# Altium schematic sheet MCU And Peripherals.SchDoc
size A4; SheetNumber: 2; SheetTotal: 4
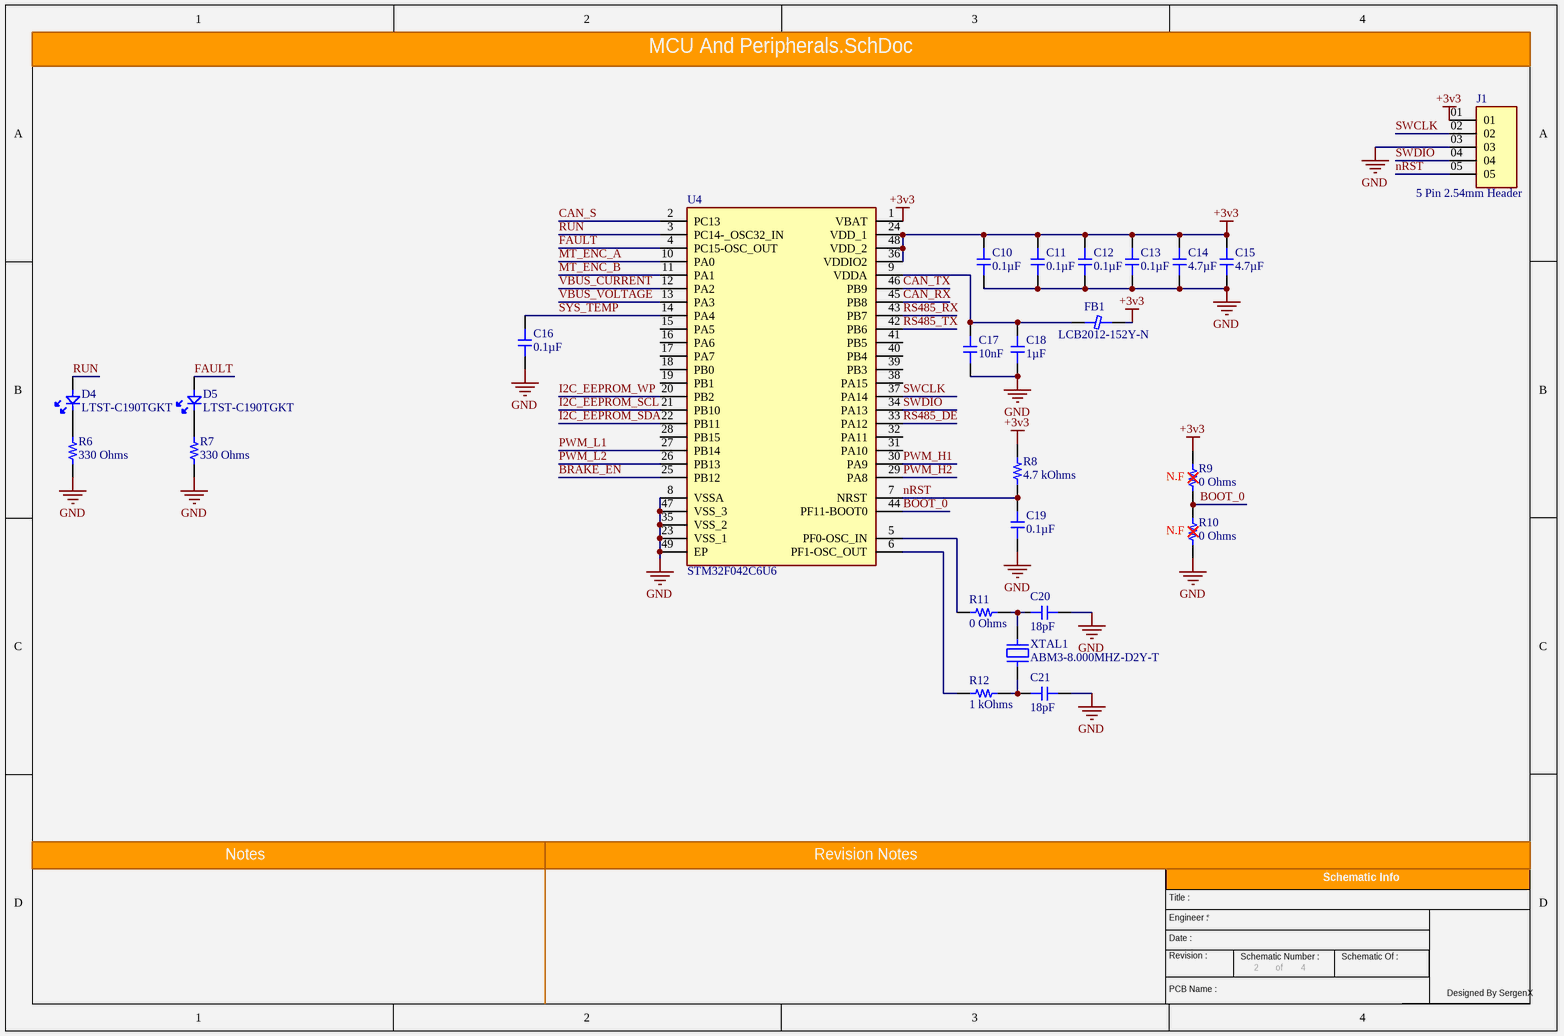
[diagram p0: MCU And Peripherals.SchDoc]

## Parts
C10  0.1µF  [0603_Footprint]
C11  0.1µF  [0603_Footprint]
C12  0.1µF  [0603_Footprint]
C13  0.1µF  [0603_Footprint]
C14  4.7µF  [0603_Footprint]
C15  4.7µF  [0603_Footprint]
C16  0.1µF  [0603_Footprint]
C17  10nF  [0603_Footprint]
C18  1µF  [0603_Footprint]
C19  0.1µF  [0603_Footprint]
C20  18pF  [0603_Footprint]
C21  18pF  [0603_Footprint]
D4  LTST-C190TGKT  [LEDC1608X80N]
D5  LTST-C190TGKT  [LEDC1608X80N]
FB1  LCB2012-152Y-N  [Inductor-0805]
J1  5 Pin 2.54mm Header  [5PIN_254MM]
R6  330 Ohms  [0603_RES]
R7  330 Ohms  [0603_RES]
R8  4.7 kOhms  [0603_RES]
R9  0 Ohms  [0603_RES]
R10  0 Ohms  [0603_RES]
R11  0 Ohms  [0603_RES]
R12  1 kOhms  [0603_RES]
U4  STM32F042C6U6  [QFN50P700X700X60-49N]
XTAL1  ABM3-8.000MHZ-D2Y-T  [ABM3]

## Nets
+3v3: C10.1 C11.1 C12.1 C13.1 C14.1 C15.1 FB1.2 J1.01 R8.2 R9.2 U4.1(VBAT) U4.24(VDD_1) U4.36(VDDIO2) U4.48(VDD_2)
GND: C10.2 C11.2 C12.2 C13.2 C14.2 C15.2 C16.2 C17.2 C18.2 C19.1 C20.2 C21.2 J1.03 R6.1 R7.1 R10.1 U4.8(VSSA) U4.23(VSS_1) U4.35(VSS_2) U4.47(VSS_3) U4.49(EP)
BOOT_0: R9.1 R10.2 U4.44(PF11-BOOT0)
BRAKE_EN: U4.25(PB12)
CAN_RX: U4.45(PB8)
CAN_S: U4.2(PC13)
CAN_TX: U4.46(PB9)
FAULT: D5.2(A) U4.4(PC15-OSC_OUT)
I2C_EEPROM_SCL: U4.21(PB10)
I2C_EEPROM_SDA: U4.22(PB11)
I2C_EEPROM_WP: U4.20(PB2)
MT_ENC_A: U4.10(PA0)
MT_ENC_B: U4.11(PA1)
nRST: C19.2 J1.05 R8.1 U4.7(NRST)
PWM_H1: U4.30(PA9)
PWM_H2: U4.29(PA8)
PWM_L1: U4.27(PB14)
PWM_L2: U4.26(PB13)
RS485_DE: U4.33(PA12)
RS485_RX: U4.43(PB7)
RS485_TX: U4.42(PB6)
RUN: D4.2(A) U4.3(PC14-_OSC32_IN)
SWCLK: J1.02 U4.37(PA14)
SWDIO: J1.04 U4.34(PA13)
SYS_TEMP: C16.1 U4.14(PA4)
VBUS_CURRENT: U4.12(PA2)
VBUS_VOLTAGE: U4.13(PA3)
NetC17_1: C17.1 C18.1 FB1.1 U4.9(VDDA)
NetC20_1: C20.1 R11.2 XTAL1.2
NetC21_1: C21.1 R12.2 XTAL1.1
NetD4_1: D4.1(K) R6.2
NetD5_1: D5.1(K) R7.2
NetR11_1: R11.1 U4.5(PF0-OSC_IN)
NetR12_1: R12.1 U4.6(PF1-OSC_OUT)

Not connected (* = marked no-connect by the designer): U4 15(PA5) 16(PA6) 17(PA7) 18(PB0) 19(PB1) 28(PB15) 31(PA10) 32(PA11) 38(PA15) 39(PB3) 40(PB4) 41(PB5)

## Notes on the sheet
- (near R9) N.F
- (near R10) N.F
- Notes
- Revision Notes
- Title :
- Engineer :
- Schematic Info
- Date :
- Revision :
- PCB Name :
- Schematic Number :
- of
- Schematic Of :
- Designed By SergenX

## Library data of the parts
C10-C13 C16 C19 = 0.1uF 0603 Surface Capacitor
C14 C15 = 4.7uF 0603 Surface Capacitor
C17 = 10nF 0603 Surface Capacitor
C18 = 1uF 0603 Surface Capacitor
C20 C21 = 18pF 0603 Surface Capacitor
D4 D5 = LTST-C190TGKT: 20mA Generic 0603 Led SMD; Manufacturer_Name: Lite-On; Manufacturer_Part_Number: LTST-C190KRKT; Datasheet Link: https://componentsearchengine.com/Datasheets/1/LTST-C190KRKT.pdf; Height: 0.8mm; Mouser Part Number: 859-LTST-C190KRKT; Mouser Price/Stock: https://www.mouser.co.uk/ProductDetail/Lite-On/LTST-C190KRKT?qs=kAD5fFa1n5VY3YYNWPC1Fg%3D%3D; Arrow Part Number: LTST-C190KRKT; Arrow Price/Stock: https://www.arrow.com/en/products/ltst-c190krkt/lite-on-technology?region=europe
FB1 = LCB2012-152Y-N: Ferrite Bead 1A 0805 SMD
J1 = 5 Pin 2.54mm Header: Generic 2.54MM 5 Pin Header; MP: MTSW-105-09-G-S-480; Availability: Unavailable; Package: None; Value: *; Price: None
R6 R7 = 330 Ohm 0603
R8 = 4.7 kOhms 0603
R9-R11 = 0 Ohm 0603
R12 = 1 kOhms 0603
U4 = STM32F042C6U6: STMICROELECTRONICS - STM32F042C6U6 - MCU, ARM CORTEX-M0, 48MHZ, UFQFPN-48; Geometry.Height: 0.65mm; Manufacturer_Name: STMicroelectronics; Manufacturer_Part_Number: STM32F042C6U6; Mouser Part Number: 511-STM32F042C6U6; Mouser Price/Stock: https://www.mouser.co.uk/ProductDetail/STMicroelectronics/STM32F042C6U6?qs=4l9S5vBWkUI%2FX%2FLe94sSqA%3D%3D; Arrow Part Number: STM32F042C6U6; Arrow Price/Stock: https://www.arrow.com/en/products/stm32f042c6u6/stmicroelectronics; Datasheet Link: https://www.st.com/resource/en/datasheet/stm32f042c6.pdf
XTAL1 = ABM3-8.000MHZ-D2Y-T: 8MHz 2 Pin SMD Crystal; Manufacturer_Name: ABRACON; Datasheet Link: https://abracon.com/Resonators/abm3.pdf; Height: 1.3mm; Manufacturer_Part_Number: ABM3-8.000MHZ-D2Y-T; Mouser Part Number: 815-ABM3-8-D2Y-T; Mouser Price/Stock: https://www.mouser.co.uk/ProductDetail/ABRACON/ABM3-8.000MHZ-D2Y-T?qs=ihRgKfnEsN4giUXjc3yS1g%3D%3D; Arrow Part Number: ABM3-8.000MHZ-D2Y-T; Arrow Price/Stock: https://www.arrow.com/en/products/abm3-8.000mhz-d2y-t/abracon?region=europe